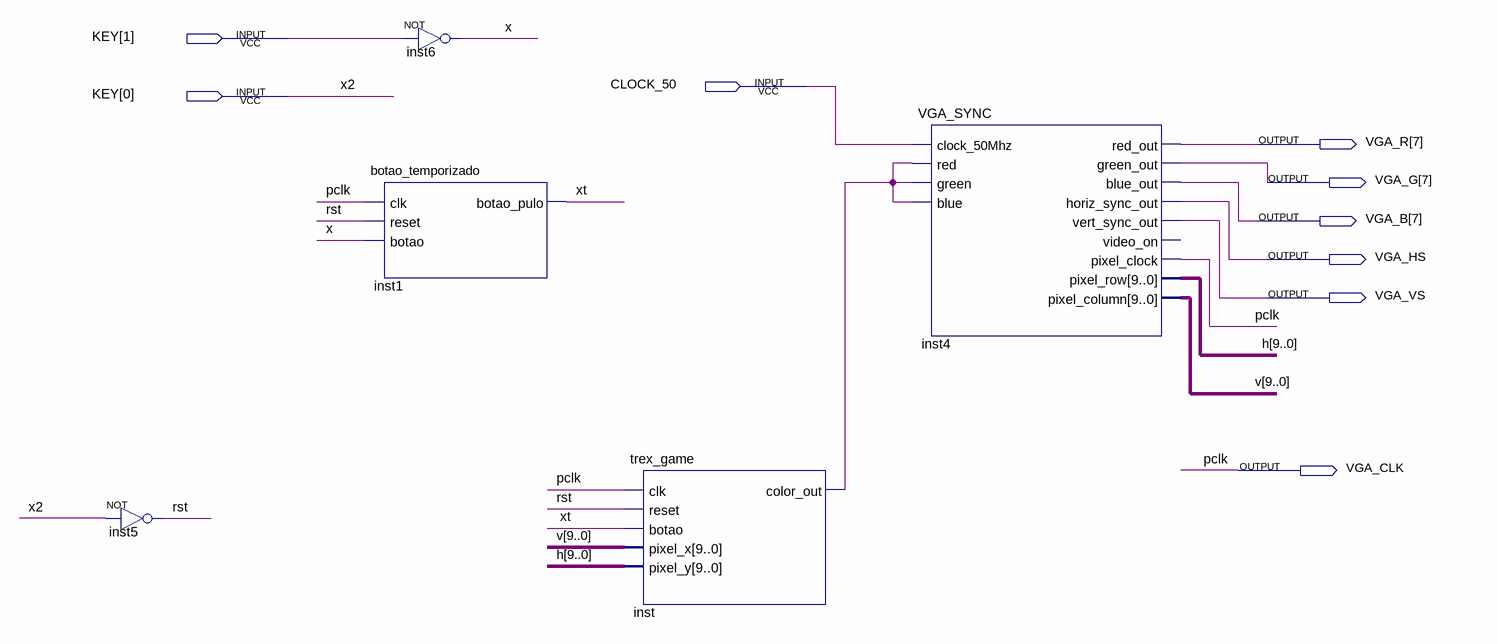
[diagram p0: schematic sheet]
// Quartus schematic pratica4.bdf as structural Verilog: 5 symbols, 9 pins
module pratica4 (
  input  [1:0] KEY,
  input  CLOCK_50,
  output [7:7] VGA_R,
  output [7:7] VGA_G,
  output [7:7] VGA_B,
  output VGA_HS,
  output VGA_VS,
  output VGA_CLK
);

  wire inst_color_out, rst, x, xt;
  wire [9:0] h, v;

  not inst5 (rst, KEY[0]);
  not inst6 (x, KEY[1]);
  botao_temporizado inst1 (.clk(VGA_CLK), .reset(rst), .botao(x), .botao_pulo(xt));
  trex_game inst (.clk(VGA_CLK), .reset(rst), .botao(xt), .pixel_x(v), .pixel_y(h), .color_out(inst_color_out));
  VGA_SYNC inst4 (
    .clock_50Mhz(CLOCK_50), .red(inst_color_out), .green(inst_color_out), .blue(inst_color_out),
    .red_out(VGA_R[7]), .green_out(VGA_G[7]), .blue_out(VGA_B[7]), .horiz_sync_out(VGA_HS),
    .vert_sync_out(VGA_VS), .pixel_clock(VGA_CLK), .pixel_row(h), .pixel_column(v));  // open: video_on

  // Other names for the same wires on the sheet: pclk = VGA_CLK; x2 = KEY[0]
endmodule
